# Altium schematic sheet 2_PowerPerif.SchDoc
size 414 x 293 mm; SheetNumber: 2; SheetTotal: 4
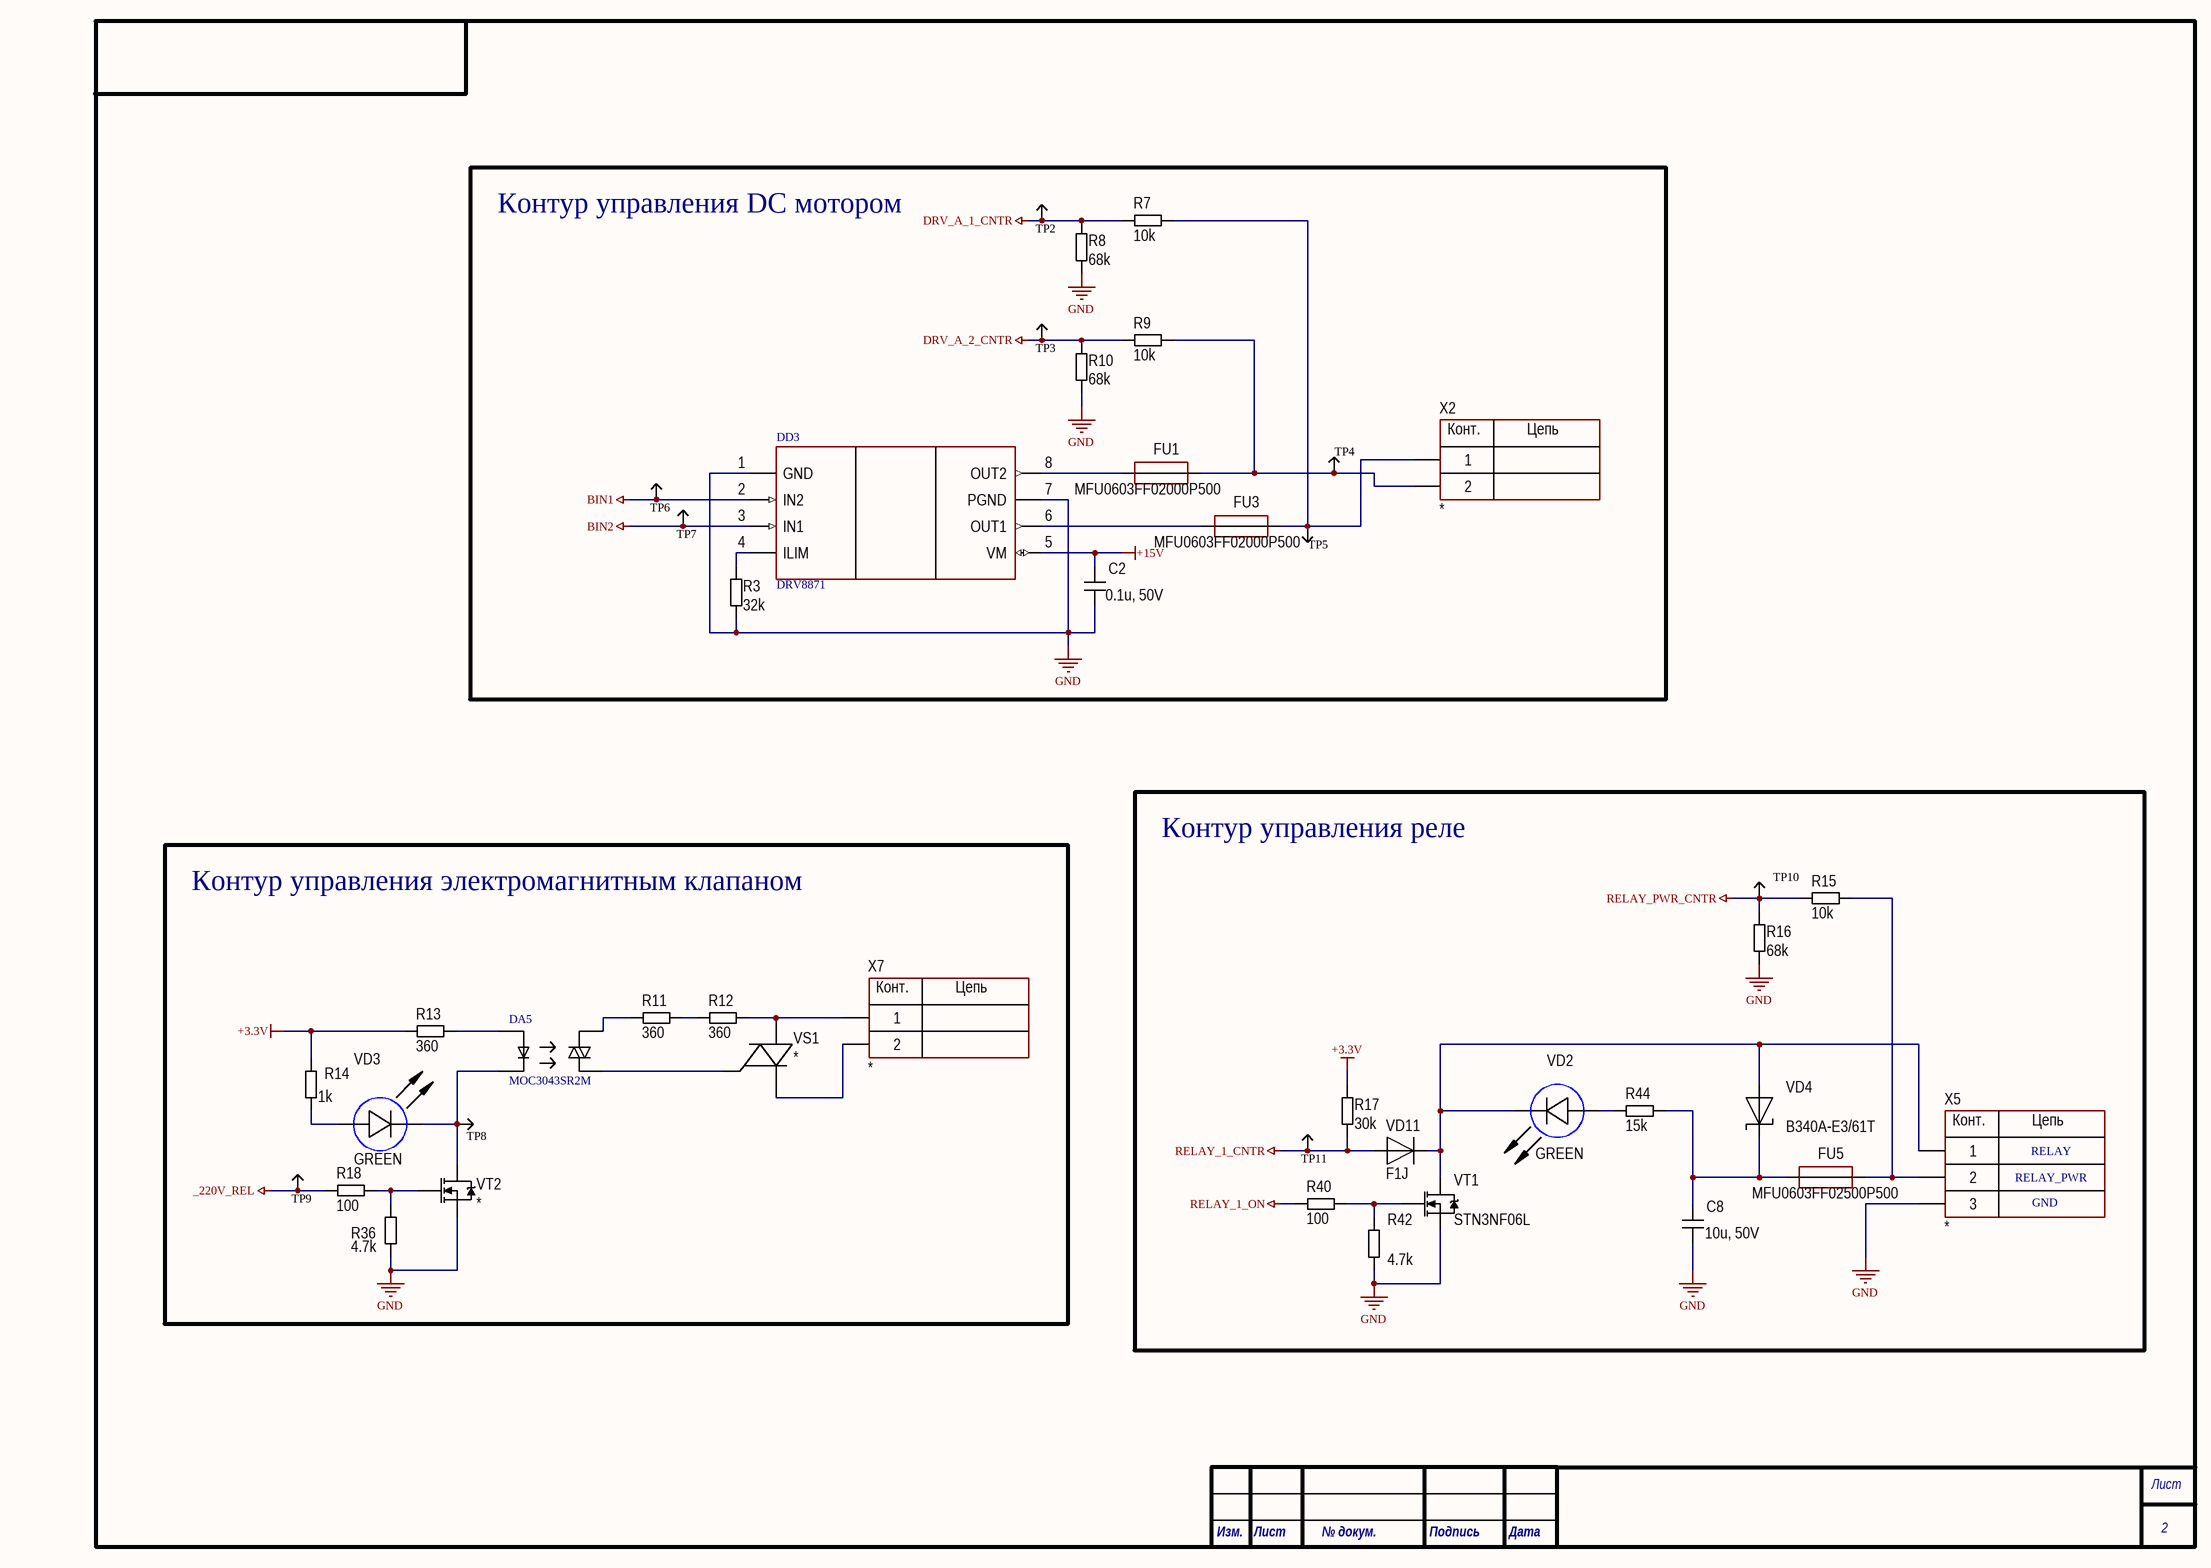
[diagram p0: 2_PowerPerif.SchDoc]

## Parts
C2  0.1u, 50V  [CH0402C]
C8  10u, 50V  [CH1206C]
DA5  MOC3043SR2M  [DIP6]
DD3  DRV8871  [8-HSOP]
FU1  MFU0603FF02000P500  [CH0603F]
FU3  MFU0603FF02000P500  [CH0603F]
FU5  MFU0603FF02500P500  [CH0603F]
R3  32k  [CH0603R]
R7  10k  [CH0402R]
R8  68k  [CH0402R]
R9  10k  [CH0402R]
R10  68k  [CH0402R]
R11  360  [CH1206R]
R12  360  [CH1206R]
R13  360  [CH0805R]
R14  1k  [CH0805R]
R15  10k  [CH0402R]
R16  68k  [CH0402R]
R17  30k  [CH0402R]
R18  100  [CH0805R]
R36  4.7k  [CH0402R]
R40  100  [CH0805R]
R42  4.7k  [CH0402R]
R44  15k  [CH0805R]
TP2  (no value)  [TestPoint]
TP3  (no value)  [TestPoint]
TP4  (no value)  [TestPoint]
TP5  (no value)  [TestPoint]
TP6  (no value)  [TestPoint]
TP7  (no value)  [TestPoint]
TP8  (no value)  [TestPoint]
TP9  (no value)  [TestPoint]
TP10  (no value)  [TestPoint]
TP11  (no value)  [TestPoint]
VD2  GREEN  [CH0603LB]
VD3  GREEN  [CH0603LB]
VD4  B340A-E3/61T  [SMA]
VD11  F1J  [SOD123F]
VS1  *  [SOT223_G-D-S]
VT1  STN3NF06L  [SOT223_G-D-S]
VT2  *  [SOT23_123]
X2  *  [CON: MX-22-05-3021]
X5  *  [CON: 300-03P-5.0]
X7  *  [CON: 300-02P-5.0]

## Blocks framed on the sheet
Контур управления DC мотором: C2 DD3 FU1 FU3 R3 R7-R10 TP2-TP7 X2
Контур управления реле: C8 FU5 R15-R17 R40 R42 R44 TP10 TP11 VD2 VD4 VD11 VT1 X5
Контур управления электромагнитным клапаном: DA5 R11-R14 R18 R36 TP8 TP9 VD3 VS1 VT2 X7

## Nets
+3.3V: R13.2 R14.2 R17.2
+15V: C2.2 DD3.5(VM)
_220V_REL: R18.2 TP9.0
BIN1: DD3.2(IN2) TP6.0
BIN2: DD3.3(IN1) TP7.0
DRV_A_1_CNTR: R7.1 R8.2 TP2.0
DRV_A_2_CNTR: R9.1 R10.2 TP3.0
GND: C2.1 C8.1 DD3.1(GND) DD3.7(PGND) R3.1 R8.1 R10.1 R16.1 R36.1 R42.1 VT1.3(S) VT2.3(S) X5.3
RELAY_1_CNTR: R17.1 TP11.0 VD11.1
RELAY_1_ON: R40.2
RELAY_PWR_CNTR: R15.1 R16.2 TP10.0
NetC8_2: C8.2 FU5.1 R44.2 VD4.2
NetDA5_1: DA5.1(Vpr+) R13.1
NetDA5_2: DA5.2(Vpr-) TP8.0 VD3.2(C) VT2.2(D)
NetDA5_4: DA5.4 R11.2
NetDA5_6: DA5.6 VS1.3
NetDD3_4: DD3.4(ILIM) R3.2
NetDD3_6: DD3.6(OUT1) FU3.1
NetDD3_8: DD3.8(OUT2) FU1.1
NetFU1_2: FU1.2 R9.2 TP4.0 X2.2
NetFU3_2: FU3.2 R7.2 TP5.0 X2.1
NetFU5_2: FU5.2 R15.2 X5.2
NetR11_1: R11.1 R12.2
NetR12_1: R12.1 VS1.2 X7.1
NetR14_1: R14.1 VD3.1(A)
NetR18_1: R18.1 R36.2 VT2.1(G)
NetR40_1: R40.1 R42.2 VT1.1(G)
NetR44_1: R44.1 VD2.1(A)
NetVD2_2: VD2.2(C) VD4.1 VD11.2 VT1.2(D) X5.1
NetVS1_1: VS1.1 X7.2

## Notes on the sheet
- RELAY
- RELAY_PWR
- GND
- Лист
- Изм.
- № докум.
- Подпись
- Дата
- (in symbol 2-Connector) Конт.; Цепь
- (in symbol 3-Connector) Конт.; Цепь

## Library data of the parts
C2 C8 = Capacitor: Manufacturer: *; Model: *; HelpURL: *; ComponentKind: *; Value: *
DA5 = MOC3063
FU1 FU3 FU5 = Fuse: Manufacturer: *; Model: *; HelpURL: *; ComponentKind: *; Value: *
R3 R7-R18 R36 R40 R42 R44 = Resistor: Manufacturer: *; Model: *; HelpURL: *; ComponentKind: *; Value: *
TP2-TP11 = TestPoint
VD2 VD3 = LED_1: Manufacturer: *; Model: *; HelpURL: *; ComponentKind: *; Value: *
VD4 = Diod Schottky: ComponentKind: *; Manufacturer: *; Model: *; HelpURL: *
VD11 = Diod: ComponentKind: *; Manufacturer: *; Model: *; HelpURL: *
VS1 = TRIAC: Bipolar; Model: *; Manufacturer: *; ComponentKind: *; HelpURL: *
VT1 VT2 = N-chanel: Mosfet; Manufacturer: *; ComponentKind: *; HelpURL: *
  VT1: Model: STN3NF06L
  VT2: Model: *
X2 X7 = 2-Connector: Model: *; Manufacturer: *; HelpURL: *; ComponentKind: *
X5 = 3-Connector: Model: *; Manufacturer: *; HelpURL: *; ComponentKind: *